# Altium schematic sheet Board-Ultrasonic.SchDoc: =ProjectTitle
size 297 x 209 mm; Address1: Address1; Address2: Address2; Address3: Address3; Address4: Address4; SheetNumber: 5; SheetTotal: 6; Scale: 1:1; DocumentType: Схема электрическая принципиальная
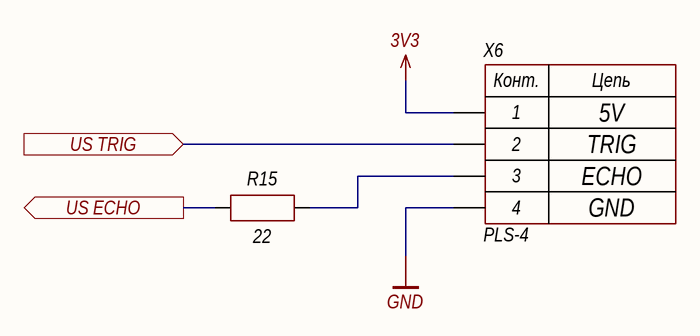
[diagram p0: Board-Ultrasonic.SchDoc]

## Parts
R15  22  [CH0402R]
X6  PLS-4  [CON: PLS-4]

## Ports
US ECHO (out), US TRIG (in)

## Nets
3V3: X6.1
GND: X6.4
US ECHO: R15.1 ; port US ECHO
US TRIG: X6.2 ; port US TRIG
NetR15_2: R15.2 X6.3

## Notes on the sheet
- 5V
- ECHO
- TRIG
- GND
- Изм.
- Лист
- № докум.
- Подп.
- Дата
- Копировал
- Формат А4
- (in symbol 4-Connector) Конт.; Цепь

## Library data of the parts
R15 = Resistor: Manufacturer: YAGEO; Model: RC0402FR-0722RL; HelpURL: https://lcsc.com/product-detail/Chip-Resistor-Surface-Mount_22R-22R0-1_C114765.html; ComponentKind: ±1%; Value: 22
X6 = 4-Connector: Model: PLS-4; Manufacturer: *; HelpURL: *; ComponentKind: *